# Altium schematic sheet Sheet1.SchDoc
size A4
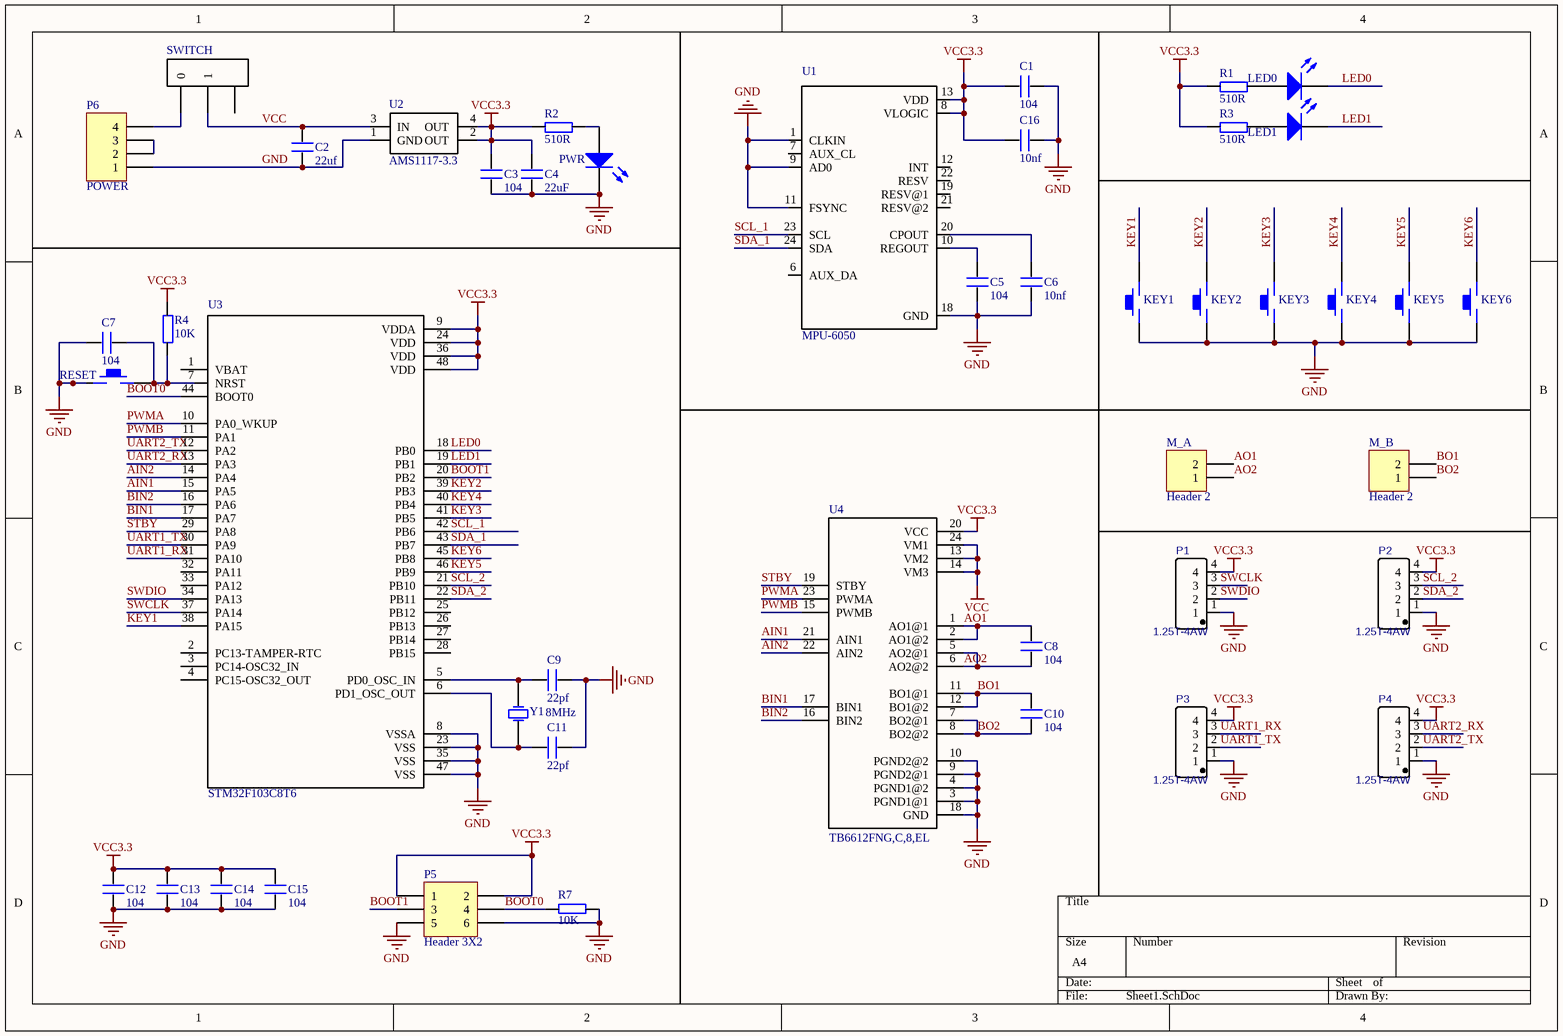
[diagram p0: Sheet1.SchDoc]

## Parts
1  LED0  [*0805]
2  LED1  [*0805]
C1  104  [*0805]
C2  22uf  [*0805]
C3  104  [*0805]
C4  22uF  [*0805]
C5  104  [*0805]
C6  10nf  [*0805]
C7  104  [*0805]
C8  104  [*0805]
C9  22pf  [*0805]
C10  104  [*0805]
C11  22pf  [*0805]
C12  104  [*0805]
C13  104  [*0805]
C14  104  [*0805]
C15  104  [*0805]
C16  10nf  [*0805]
KEY1  KEY  [*KEY]  (value not drawn)
KEY2  KEY  [*KEY]  (value not drawn)
KEY3  KEY  [*KEY]  (value not drawn)
KEY4  KEY  [*KEY]  (value not drawn)
KEY5  KEY  [*KEY]  (value not drawn)
KEY6  KEY  [*KEY]  (value not drawn)
LED  PWR  [*0805]
M_A  Header 2  [HDR1X2]
M_B  Header 2  [HDR1X2]
P1  1.25T-4AW  [*1.25T-4AW]
P2  1.25T-4AW  [*1.25T-4AW]
P3  1.25T-4AW  [*1.25T-4AW]
P4  1.25T-4AW  [*1.25T-4AW]
P5  Header 3X2  [HDR2X3]
P6  POWER  [HDR1X4]
R1  510R  [*0805]
R2  510R  [*0805]
R3  510R  [*0805]
R4  10K  [*0805]
R7  10K  [*0805]
RESET  KEY  [*KEY]  (value not drawn)
SWITCH  SWITCH  [*SWITCH]  (value not drawn)
U1  MPU-6050  [*QFN50P400X400X95-24N]
U2  AMS1117-3.3  [*AMS1117]
U3  STM32F103C8T6  [*QFP50P900X900X160-48N]
U4  TB6612FNG,C,8,EL  [*SOP65P760X160-24N]
Y1  8MHz  [*XTAL]

## Nets
GND: C1.1 C2.1 C3.1 C4.1 C5.1 C6.1 C7.1 C9.2 C11.2 C12.1 C13.1 C14.1 C15.1 C16.1 KEY1.1 KEY2.1 KEY3.1 KEY4.1 KEY5.1 KEY6.1 LED.2(K) P1.1 P2.1 P3.1 P4.1 P5.5 P5.6 P6.1 R7.1 RESET.1 U1.1(CLKIN) U1.9(AD0) U1.11(FSYNC) U1.18(GND) U2.1(GND) U3.8(VSSA) U3.23(VSS) U3.35(VSS) U3.47(VSS) U4.3(PGND1@1) U4.4(PGND1@2) U4.9(PGND2@1) U4.10(PGND2@2) U4.18(GND)
VCC: C2.2 SWITCH.1 U2.3(IN) U4.13(VM2) U4.14(VM3) U4.24(VM1)
VCC3.3: C1.2 C3.2 C4.2 C12.2 C13.2 C14.2 C15.2 C16.2 P1.4 P2.4 P3.4 P4.4 P5.1 P5.2 R1.1 R2.1 R3.1 R4.2 U1.8(VLOGIC) U1.13(VDD) U2.2(OUT) U2.4(OUT) U3.9(VDDA) U3.24(VDD) U3.36(VDD) U3.48(VDD) U4.20(VCC)
AIN1: U3.15(PA5) U4.21(AIN1)
AIN2: U3.14(PA4) U4.22(AIN2)
AO1: C8.2 M_A.2 U4.1(AO1@1) U4.2(AO1@2)
AO2: C8.1 M_A.1 U4.5(AO2@1) U4.6(AO2@2)
BIN1: U3.17(PA7) U4.17(BIN1)
BIN2: U3.16(PA6) U4.16(BIN2)
BO1: C10.2 M_B.2 U4.11(BO1@1) U4.12(BO1@2)
BO2: C10.1 M_B.1 U4.7(BO2@1) U4.8(BO2@2)
BOOT0: P5.4 R7.2 U3.44(BOOT0)
BOOT1: P5.3 U3.20(PB2)
KEY1: KEY1.2 U3.38(PA15)
KEY2: KEY2.2 U3.39(PB3)
KEY3: KEY3.2 U3.41(PB5)
KEY4: KEY4.2 U3.40(PB4)
KEY5: KEY5.2 U3.46(PB9)
KEY6: KEY6.2 U3.45(PB8)
LED0: 1.2(K) U3.18(PB0)
LED1: 2.2(K) U3.19(PB1)
PWMA: U3.10(PA0_WKUP) U4.23(PWMA)
PWMB: U3.11(PA1) U4.15(PWMB)
SCL_1: U1.23(SCL) U3.42(PB6)
SCL_2: P2.3 U3.21(PB10)
SDA_1: U1.24(SDA) U3.43(PB7)
SDA_2: P2.2 U3.22(PB11)
STBY: U3.29(PA8) U4.19(STBY)
SWCLK: P1.3 U3.37(PA14)
SWDIO: P1.2 U3.34(PA13)
UART1_RX: P3.3 U3.31(PA10)
UART1_TX: P3.2 U3.30(PA9)
UART2_RX: P4.3 U3.13(PA3)
UART2_TX: P4.2 U3.12(PA2)
Net1_1: 1.1(A) R1.2
Net2_1: 2.1(A) R3.2
NetC5_2: C5.2 U1.10(REGOUT)
NetC6_2: C6.2 U1.20(CPOUT)
NetC7_2: C7.2 R4.1 RESET.2 U3.7(NRST)
NetC9_1: C9.1 U3.5(PD0_OSC_IN) Y1.1(OSC2)
NetC11_1: C11.1 U3.6(PD1_OSC_OUT) Y1.0(OSC1)
NetLED_1: LED.1(A) R2.2
NetP6_2: P6.2 P6.3
NetP6_4: P6.4 SWITCH.0

Not connected (* = marked no-connect by the designer): SWITCH 2; U1 6(AUX_DA) 7(AUX_CL) 12(INT) 19(RESV@1) 21(RESV@2) 22(RESV); U3 1(VBAT) 2(PC13-TAMPER-RTC) 3(PC14-OSC32_IN) 4(PC15-OSC32_OUT) 25(PB12) 26(PB13) 27(PB14) 28(PB15) 32(PA11) 33(PA12)

## Library data of the parts
1 2 LED = LED2: Typical RED, GREEN, YELLOW, AMBER GaAs LED; Published: 8-Jun-2000; LatestRevisionDate: 17-Jul-2002; LatestRevisionNote: Re-released for DXP Platform.; PackageDocument: Feb-2002; PackageReference: 3.2X1.6X1.1; Publisher: Altium Limited
C1-C16 = C
M_A M_B = Header 2: Header, 2-Pin; LatestRevisionDate: 17-Jul-2002; LatestRevisionNote: Re-released for DXP Platform.; Publisher: Altium Limited
P1-P4 = 1.25T-4AW: BOM_Manufacturer: BOOMELE; spicePre: X; BOM_Supplier: LCSC; BOM_Manufacturer Part: 1.25T-4AW; BOM_Supplier Part: C14939
P5 = Header 3X2: Header, 3-Pin, Dual row; LatestRevisionDate: 17-Jul-2002; LatestRevisionNote: Re-released for DXP Platform.; Publisher: Altium Limited
P6 = Header 4: Header, 4-Pin; LatestRevisionDate: 17-Jul-2002; LatestRevisionNote: Re-released for DXP Platform.; Publisher: Altium Limited
R1-R4 R7 = R
SWITCH = SWITCH: pin to pad: 2>none
U1 = MPU-6050: 3-axis gyroscope, 3-axis accelerometer in a 4x4x0.9 housing; MF: TDK InvenSense; Digi-Key_Part_Number: 1428-1007-1-ND; Package: QFN-24 InvenSense; Digi-Key_Purchase_URL: https://www.digikey.com.cn/product-detail/zh/tdk-invensense/MPU-6050/1428-1007-1-ND/4038010?utm_source=snapeda&utm_medium=aggregator&utm_campaign=symbol; SnapEDA_Link: https://www.snapeda.com/parts/MPU-6050/TDK%20InvenSense/view-part/?ref=snap; MP: MPU-6050; Value: *
U2 = AMS1117
U3 = STM32F103C8T6: Mainstream Performance line, ARM Cortex-M3 MCU with 64 Kbytes Flash, 72 MHz CPU, motor control, USB and CAN; MF: STMicroelectronics; MP: STM32F103C8T6; Digi-Key_Part_Number: *; Package: LQFP-48 STMicroelectronics; SnapEDA_Link: https://www.snapeda.com/parts/STM32F103C8T6/STMicroelectronics/view-part/?ref=snap; Digi-Key_Purchase_URL: *; Value: *
U4 = TB6612FNG,C,8,EL: Stepping Motor Driver Ic Unipolor Copper Wire 8; MF: Toshiba; MP: TB6612FNG,C,8,EL; Digi-Key_Part_Number: TB6612FNGC8ELCT-ND; Package: SSOP-24 Toshiba; SnapEDA_Link: https://www.snapeda.com/parts/TB6612FNG%2CC%2C8%2CEL/Toshiba%20Semiconductor%20and%20Storage/view-part/?ref=snap; Digi-Key_Purchase_URL: https://www.digikey.com.cn/product-detail/zh/toshiba-semiconductor-and-storage/TB6612FNG,C,8,EL/TB6612FNGC8ELCT-ND/1730134?utm_source=snapeda&utm_medium=aggregator&utm_campaign=symbol; Value: *
Y1 = XTAL: Crystal Oscillator; Published: 8-Jun-2000; LatestRevisionDate: 17-Jul-2002; LatestRevisionNote: Re-released for DXP Platform.; Publisher: Altium Limited